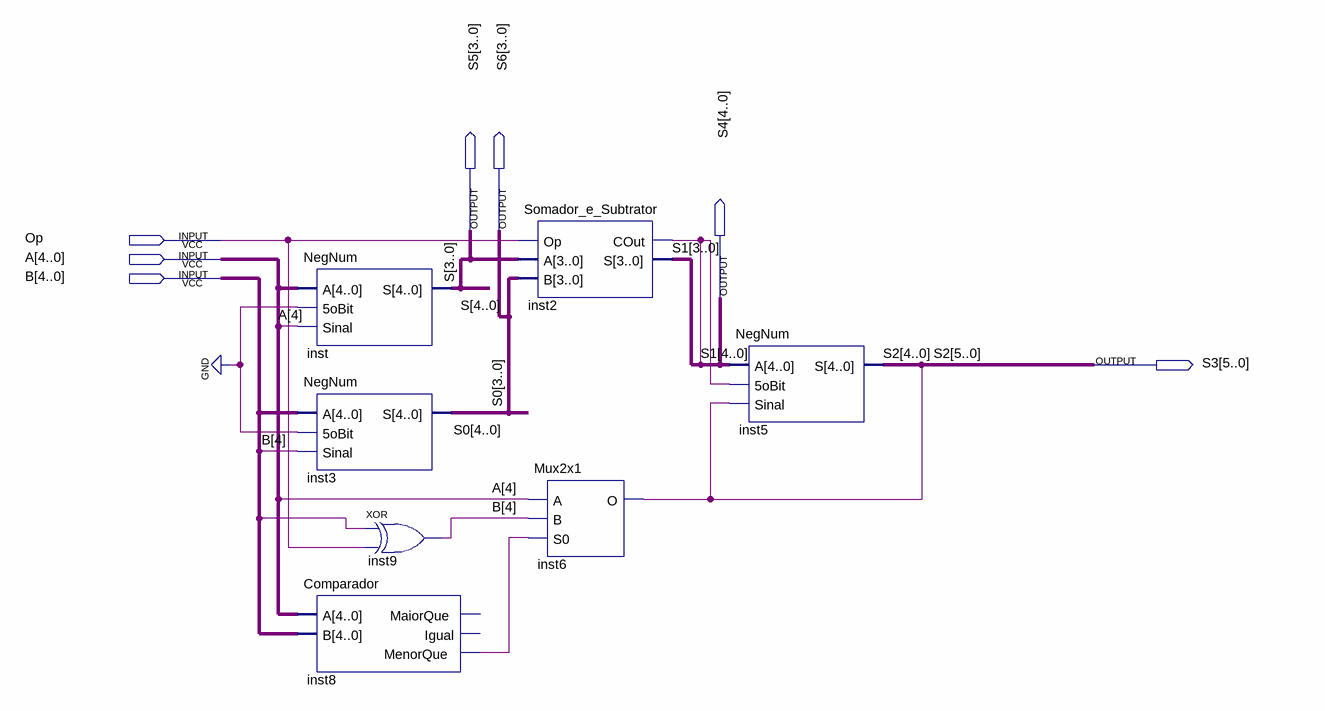
[diagram p0: schematic sheet]
// Quartus schematic TESTESUM.bdf as structural Verilog: 7 symbols, 7 pins
module TESTESUM (
  input  Op,
  input  [4:0] A,
  input  [4:0] B,
  output [3:0] S5,
  output [3:0] S6,
  output [4:0] S4,
  output [5:0] S3
);

  wire inst2_cout, inst6_o, inst8_menorque, inst9_out;
  wire [4:4] S, S0;

  NegNum inst (.A(A), .\5oBit (1'b0), .Sinal(A[4]), .S({S[4], S5}));
  NegNum inst3 (.A(B), .\5oBit (1'b0), .Sinal(B[4]), .S({S0[4], S6}));
  Comparador inst8 (.A(A), .B(B), .MenorQue(inst8_menorque));  // open: MaiorQue, Igual
  xor inst9 (inst9_out, B[4], Op);
  Somador_e_Subtrator inst2 (.Op(Op), .A(S5), .B(S6), .COut(inst2_cout), .S(S4[3:0]));
  Mux2x1 inst6 (.A(A[4]), .B(inst9_out), .S0(inst8_menorque), .O(inst6_o));
  NegNum inst5 (.A(S4), .\5oBit (inst2_cout), .Sinal(inst6_o), .S(S3[4:0]));

  // Other names for the same wires on the sheet: S2[5:0] = S3; S1[4:0] = S4; S[3:0] = S5; S0[3:0] = S6
endmodule
